# Altium schematic sheet Motor_PeltierDrivers.SchDoc
size A4; SheetNumber: 1; SheetTotal: 1
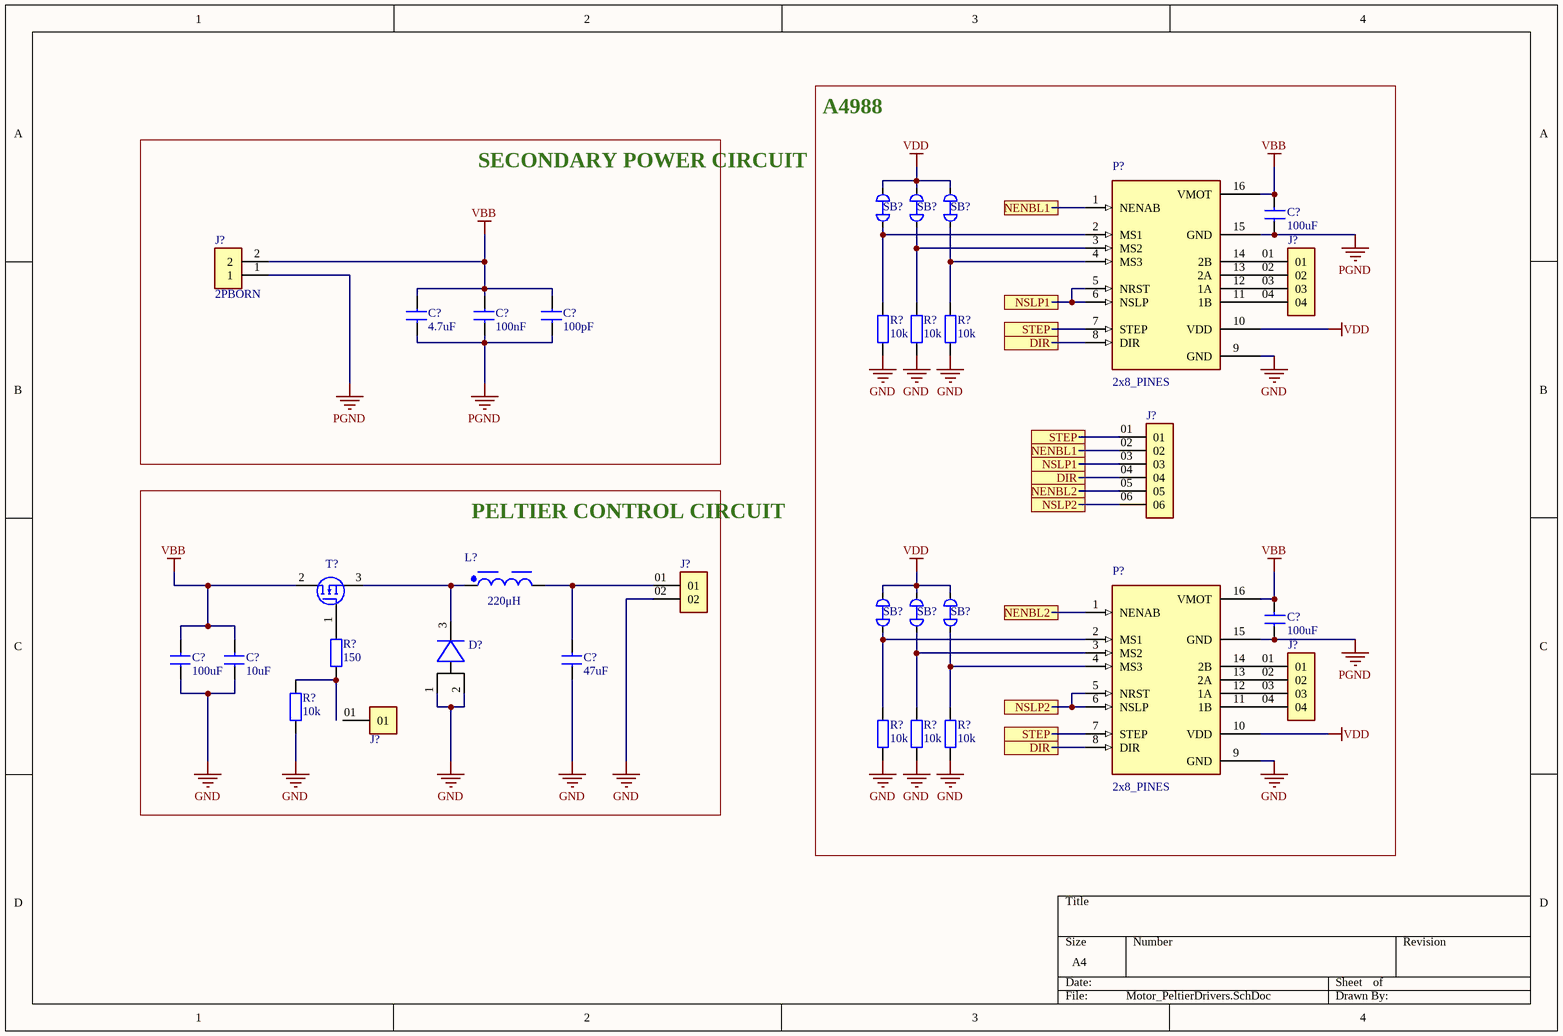
[diagram p0: Motor_PeltierDrivers.SchDoc]

## Parts
(Parts that share a designator on the sheet are numbered #1, #2 ... from top to bottom, then left to right.)
C?#1  100uF  [RES_0805]
C?#2  4.7uF  [RES_0805]
C?#3  100nF  [RES_0805]
C?#4  100pF  [RES_0805]
C?#5  100uF  [RES_0805]
C?#6  100uF  [RES_0805]
C?#7  10uF  [RES_0805]
C?#8  47uF  [RES_0805]
D?  DIODE_FSV15150V  [FSV15150V_TO-277]  (value not drawn)
J?#1  2PBORN  [CUI_TB002-500-02BE]
J?#2  PIN_HEADER_4  [GEN_PIN4]  (value not drawn)
J?#3  PIN_HEADER_6  [GEN_PIN6]  (value not drawn)
J?#4  PIN_HEADER_2  [GEN_PIN2]  (value not drawn)
J?#5  PIN_HEADER_4  [GEN_PIN4]  (value not drawn)
J?#6  PIN_HEADER_1  [GEN_PIN1]  (value not drawn)
L?  220μH  [WE-HCF_2920]
P?#1  2x8_PINES  [PINES8x2-sep]
P?#2  2x8_PINES  [PINES8x2-sep]
R?#1  10k  [RES_0805]
R?#2  10k  [RES_0805]
R?#3  10k  [RES_0805]
R?#4  150  [RES_0805]
R?#5  10k  [RES_0805]
R?#6  10k  [RES_0805]
R?#7  10k  [RES_0805]
R?#8  10k  [RES_0805]
SB?#1  SolderBridge_Short  [SolderBridge_Short]  (value not drawn)
SB?#2  SolderBridge_Short  [SolderBridge_Short]  (value not drawn)
SB?#3  SolderBridge_Short  [SolderBridge_Short]  (value not drawn)
SB?#4  SolderBridge_Short  [SolderBridge_Short]  (value not drawn)
SB?#5  SolderBridge_Short  [SolderBridge_Short]  (value not drawn)
SB?#6  SolderBridge_Short  [SolderBridge_Short]  (value not drawn)
T?  DMT10H010LK3  [MOSFET_TRANS_2DB1184Q-13]  (value not drawn)

## Blocks framed on the sheet
A4988: C?#1 C?#5 J?#2 J?#3 J?#5 P?#1 P?#2 R?#1-R?#3 R?#6-R?#8 SB?#1-SB?#6
SECONDARY POWER CIRCUIT: C?#2-C?#4 J?#1
PELTIER CONTROL CIRCUIT: C?#6-C?#8 D? J?#4 J?#6 L? R?#4 R?#5 T?

## Nets
GND: C?#6.1 C?#7.1 C?#8.1 D?.1(A) D?.2 J?#4.02 P?#1.9(GND) P?#2.9(GND) R?#1.1 R?#2.1 R?#3.1 R?#5.1 R?#6.1 R?#7.1 R?#8.1
PGND: C?#1.2 C?#2.1 C?#3.1 C?#4.1 C?#5.2 J?#1.1 P?#1.15(GND) P?#2.15(GND)
VBB: C?#1.1 C?#2.2 C?#3.2 C?#4.2 C?#5.1 C?#6.2 C?#7.2 J?#1.2 P?#1.16(VMOT) P?#2.16(VMOT) T?.2(D)
VDD: P?#1.10(VDD) P?#2.10(VDD) SB?#1.2 SB?#2.2 SB?#3.2 SB?#4.2 SB?#5.2 SB?#6.2
DIR: J?#3.04 P?#1.8(DIR) P?#2.8(DIR)
NENBL1: J?#3.02 P?#1.1(NENAB)
NENBL2: J?#3.05 P?#2.1(NENAB)
NSLP1: J?#3.03 P?#1.5(NRST) P?#1.6(NSLP)
NSLP2: J?#3.06 P?#2.5(NRST) P?#2.6(NSLP)
STEP: J?#3.01 P?#1.7(STEP) P?#2.7(STEP)
NetC?#8_2: C?#8.2 J?#4.01 L?.2
NetD?_3: D?.3(C) L?.1 T?.3(S)
NetJ?#2_01: J?#2.01 P?#1.14(2B)
NetJ?#2_02: J?#2.02 P?#1.13(2A)
NetJ?#2_03: J?#2.03 P?#1.12(1A)
NetJ?#2_04: J?#2.04 P?#1.11(1B)
NetJ?#5_01: J?#5.01 P?#2.14(2B)
NetJ?#5_02: J?#5.02 P?#2.13(2A)
NetJ?#5_03: J?#5.03 P?#2.12(1A)
NetJ?#5_04: J?#5.04 P?#2.11(1B)
NetP?#1_2: P?#1.2(MS1) R?#1.2 SB?#1.1
NetP?#1_3: P?#1.3(MS2) R?#2.2 SB?#2.1
NetP?#1_4: P?#1.4(MS3) R?#3.2 SB?#3.1
NetP?#2_2: P?#2.2(MS1) R?#6.2 SB?#4.1
NetP?#2_3: P?#2.3(MS2) R?#7.2 SB?#5.1
NetP?#2_4: P?#2.4(MS3) R?#8.2 SB?#6.1
NetR?#4_1: R?#4.1 R?#5.2
NetR?#4_2: R?#4.2 T?.1(G)

Not connected (* = marked no-connect by the designer): J?#6 01

## Library data of the parts
C?#1-C?#8 = CAP_0805: Generic Capacitor
J?#1 = 2PBorn-TB002-500-02BE: 2~24 Poles, Screw Type, Horizontal, 5.0 Pitch, 22~12 (AWG), Terminal Block Connector; MF: Same Sky; SnapEDA_Link: https://www.snapeda.com/parts/TB002-500-02BE/Same+Sky/view-part/?ref=snap; Package: None; Value: *; MP: TB002-500-02BE; Check_prices: https://www.snapeda.com/parts/TB002-500-02BE/Same+Sky/view-part/?ref=eda
J?#2 J?#5 = PIN_HEADER_4: Generic 40 mils drill size, 100 mils step; MF: Samtec Inc.; MP: TS-104-T-A; Check_prices: https://www.snapeda.com/parts/TS-104-T-A/Samtec+Inc./view-part/?ref=eda; Value: *; Availability: In Stock; Price: None; Package: None; SnapEDA_Link: https://www.snapeda.com/parts/TS-104-T-A/Samtec+Inc./view-part/?ref=snap; Purchase-URL: https://pricing.snapeda.com/search/part/TS-104-T-A/?ref=eda
J?#3 = PIN_HEADER_6: Generic 40 mils drill size, 100 mils step; MF: Samtec Inc.; MP: TS-106-T-A; SnapEDA_Link: https://www.snapeda.com/parts/TS-106-T-A/Samtec+Inc./view-part/?ref=snap; Package: None; Value: *; Check_prices: https://www.snapeda.com/parts/TS-106-T-A/Samtec+Inc./view-part/?ref=eda
J?#4 = PIN_HEADER_2: Generic 40 mils drill size, 100 mils step; MF: Samtec; MP: TS-102-T-A-1; Value: *; Price: None; Package: None; Check_prices: https://www.snapeda.com/parts/TS-102-T-A-1/Samtec/view-part/?ref=eda; Availability: In Stock; SnapEDA_Link: https://www.snapeda.com/parts/TS-102-T-A-1/Samtec/view-part/?ref=snap; Purchase-URL: https://pricing.snapeda.com/search/part/TS-102-T-A-1/?ref=eda
J?#6 = PIN_HEADER_1: Generic 40 mils drill size, 100 mils step; MF: Samtec; MP: TS-101-T-AA; SnapEDA_Link: https://www.snapeda.com/parts/TS-101-T-AA/Samtec/view-part/?ref=snap; Package: None; Value: *; Check_prices: https://www.snapeda.com/parts/TS-101-T-AA/Samtec/view-part/?ref=eda
L? = L220uH_74437529203221: WE-HCF SMT High Current Inductor, size 2920, 220μH, 8.15A, 40.1mΩ; Manufacturer: Wurth Elektronik; Case/Size Code: 2920; Saturation Current @ 10%: 4.1A; Saturation Current @ 30%: 5.3A; Self Resonant Frequency: 2.8MHz; Manufacturer Part Number: 74437529203221; Category: Power Inductors; Match Code: WE-HCF; ComponentLink1Description: Website Link; ComponentLink1URL: https://www.we-online.com/redexpert/article/74437529203221?ad; ComponentLink2Description: Datasheet Link; ComponentLink2URL: https://www.we-online.com/redexpert/spec/74437529203221?ad; Mount: Surface Mount; Min Operating Temperature: -40°C; Max Operating Temperature: 125°C; Packaging: Tray; Length: 28mm; Width: 25mm; Height: 20.5mm; DC Resistance Max: 40.1mΩ; Inductance: 220μH; Performance Rated Current: 8.15A
R?#1-R?#8 = RES_0805: Generic Capacitor
T? = NMOS-DMT10H010LK3